# EAGLE design PCB-ACMSLb (EAGLE 6.4)
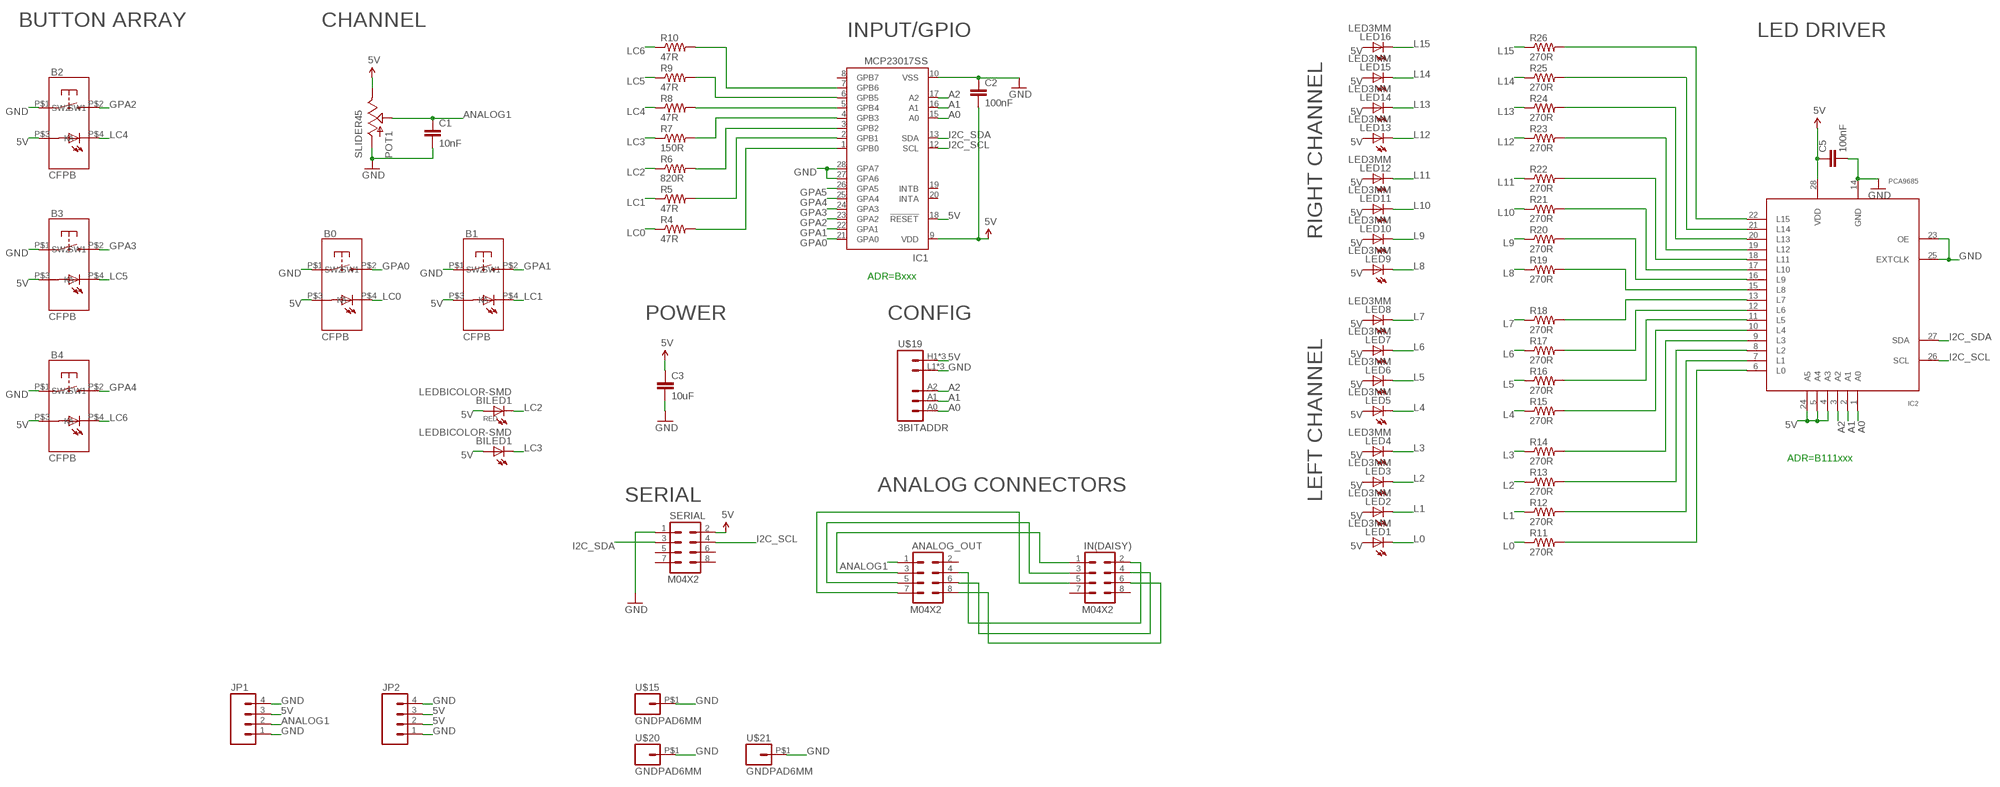
[diagram p0: schematic, sheet 1]

## Parts
ANALOG_OUT  M04X2  [2X4]
B0  CFPB  [CFPB-6/9MM]
B1  CFPB  [CFPB-6/9MM]
B2  CFPB  [CFPB-6/9MM]
B3  CFPB  [CFPB-6/9MM]
B4  CFPB  [CFPB-6/9MM]
BILED1  LEDBICOLOR-SMD  [LEDBICOLOR-SMD]
C1  10nF  CAP0603-CAP  [0603-CAP]
C2  100nF  CAP0603-CAP  [0603-CAP]
C3  10uF  CAP0805  [0805]
C5  100nF  CAP0603-CAP  [0603-CAP]
IC1  MCP23017SS  [SSOP28]
IC2  PCA9685  [TSSOP28]
IN(DAISY)  M04X2  [2X4]
JP1  M04PTH  [1X04]
JP2  M04PTH  [1X04]
LED1  LED3MM  [LED3MM]
LED2  LED3MM  [LED3MM]
LED3  LED3MM  [LED3MM]
LED4  LED3MM  [LED3MM]
LED5  LED3MM  [LED3MM]
LED6  LED3MM  [LED3MM]
LED7  LED3MM  [LED3MM]
LED8  LED3MM  [LED3MM]
LED9  LED3MM  [LED3MM]
LED10  LED3MM  [LED3MM]
LED11  LED3MM  [LED3MM]
LED12  LED3MM  [LED3MM]
LED13  LED3MM  [LED3MM]
LED14  LED3MM  [LED3MM]
LED15  LED3MM  [LED3MM]
LED16  LED3MM  [LED3MM]
POT1  SLIDER45  [SLIDER45]
R4  47R  RESISTOR0603-RES  [0603-RES]
R5  47R  RESISTOR0603-RES  [0603-RES]
R6  820R  RESISTOR0603-RES  [0603-RES]
R7  150R  RESISTOR0603-RES  [0603-RES]
R8  47R  RESISTOR0603-RES  [0603-RES]
R9  47R  RESISTOR0603-RES  [0603-RES]
R10  47R  RESISTOR0603-RES  [0603-RES]
R11  270R  RESISTOR0603-RES  [0603-RES]
R12  270R  RESISTOR0603-RES  [0603-RES]
R13  270R  RESISTOR0603-RES  [0603-RES]
R14  270R  RESISTOR0603-RES  [0603-RES]
R15  270R  RESISTOR0603-RES  [0603-RES]
R16  270R  RESISTOR0603-RES  [0603-RES]
R17  270R  RESISTOR0603-RES  [0603-RES]
R18  270R  RESISTOR0603-RES  [0603-RES]
R19  270R  RESISTOR0603-RES  [0603-RES]
R20  270R  RESISTOR0603-RES  [0603-RES]
R21  270R  RESISTOR0603-RES  [0603-RES]
R22  270R  RESISTOR0603-RES  [0603-RES]
R23  270R  RESISTOR0603-RES  [0603-RES]
R24  270R  RESISTOR0603-RES  [0603-RES]
R25  270R  RESISTOR0603-RES  [0603-RES]
R26  270R  RESISTOR0603-RES  [0603-RES]
SERIAL  M04X2  [2X4]
U$15  GNDPAD6MM  [3.2MMPAD6MM]
U$19  3BITADDR  [3BITADDR]
U$20  GNDPAD6MM  [3.2MMPAD6MM]
U$21  GNDPAD6MM  [3.2MMPAD6MM]

## Nets
5V [Power]: B0.P$3(A) B1.P$3(A) B2.P$3(A) B3.P$3(A) B4.P$3(A) BILED1.P$1(A) BILED1.P$3(A1) C2.2 C3.1 C5.1 IC1.9(VDD) IC1.18(!RESET) IC2.4(A3) IC2.5(A4) IC2.24(A5) IC2.28(VDD) JP1.3 JP2.2 JP2.3 LED1.A LED2.A LED3.A LED4.A LED5.A LED6.A LED7.A LED8.A LED9.A LED10.A LED11.A LED12.A LED13.A LED14.A LED15.A LED16.A POT1.1(E) SERIAL.2 U$19.H1(VCC) U$19.H2(VCC) U$19.H3(VCC)
A0: IC1.15(A0) IC2.1(A0) U$19.A0
A1: IC1.16(A1) IC2.2(A1) U$19.A1
A2: IC1.17(A2) IC2.3(A2) U$19.A2
ANALOG1: ANALOG_OUT.1 C1.1 JP1.2 POT1.2A(S)
GND [Power]: B0.P$1(SW1) B1.P$1(SW1) B2.P$1(SW1) B3.P$1(SW1) B4.P$1(SW1) C1.2 C2.1 C3.2 C5.2 IC1.10(VSS) IC1.27(GPA6) IC1.28(GPA7) IC2.14(GND) IC2.23(OE) IC2.25(EXTCLK) JP1.1 JP1.4 JP2.1 JP2.4 POT1.3(A) SERIAL.1 U$15.P$1 U$19.L1(GND) U$19.L2(GND) U$19.L3(GND) U$20.P$1 U$21.P$1
GPA0 [Signal]: B0.P$2(SW2) IC1.21(GPA0)
GPA1 [Signal]: B1.P$2(SW2) IC1.22(GPA1)
GPA2 [Signal]: B2.P$2(SW2) IC1.23(GPA2)
GPA3 [Signal]: B3.P$2(SW2) IC1.24(GPA3)
GPA4 [Signal]: B4.P$2(SW2) IC1.25(GPA4)
GPA5 [Signal]: IC1.26(GPA5)
I2C_SCL: IC1.12(SCL) IC2.26(SCL) SERIAL.4
I2C_SDA: IC1.13(SDA) IC2.27(SDA) SERIAL.3
L0: LED1.K(C) R11.1
L1: LED2.K(C) R12.1
L2: LED3.K(C) R13.1
L3: LED4.K(C) R14.1
L4: LED5.K(C) R15.1
L5: LED6.K(C) R16.1
L6: LED7.K(C) R17.1
L7: LED8.K(C) R18.1
L8: LED9.K(C) R19.1
L9: LED10.K(C) R20.1
L10: LED11.K(C) R21.1
L11: LED12.K(C) R22.1
L12: LED13.K(C) R23.1
L13: LED14.K(C) R24.1
L14: LED15.K(C) R25.1
L15: LED16.K(C) R26.1
LC0: B0.P$4(K) R4.1
LC1: B1.P$4(K) R5.1
LC2: BILED1.P$2(C) R6.1
LC3: BILED1.P$4(C1) R7.1
LC4: B2.P$4(K) R8.1
LC5: B3.P$4(K) R9.1
LC6: B4.P$4(K) R10.1
N$1: IC2.13(L7) R18.2
N$2: IC1.4(GPB3) R7.2
N$3: IC1.5(GPB4) R8.2
N$4: IC1.6(GPB5) R9.2
N$5: IC1.7(GPB6) R10.2
N$7: IC1.3(GPB2) R6.2
N$8: IC1.2(GPB1) R5.2
N$9: IC1.1(GPB0) R4.2
N$10: ANALOG_OUT.3 IN(DAISY).1
N$11: ANALOG_OUT.5 IN(DAISY).3
N$12: ANALOG_OUT.7 IN(DAISY).5
N$13: ANALOG_OUT.4 IN(DAISY).2
N$14: ANALOG_OUT.6 IN(DAISY).4
N$15: ANALOG_OUT.8 IN(DAISY).6
N$16: IC2.12(L6) R17.2
N$17: IC2.11(L5) R16.2
N$18: IC2.10(L4) R15.2
N$19: IC2.9(L3) R14.2
N$20: IC2.8(L2) R13.2
N$21: IC2.7(L1) R12.2
N$22: IC2.6(L0) R11.2
N$23: IC2.15(L8) R19.2
N$24: IC2.16(L9) R20.2
N$25: IC2.17(L10) R21.2
N$26: IC2.18(L11) R22.2
N$27: IC2.19(L12) R23.2
N$28: IC2.20(L13) R24.2
N$29: IC2.21(L14) R25.2
N$30: IC2.22(L15) R26.2
Unconnected: ANALOG_OUT.2 IC1.8(GPB7) IC1.19(INTB) IC1.20(INTA) IN(DAISY).7 IN(DAISY).8 SERIAL.5 SERIAL.6 SERIAL.7 SERIAL.8

## Notes on the sheet
- BUTTON ARRAY | CHANNEL
- INPUT/GPIO | LED DRIVER
- RIGHT CHANNEL
- ADR=Bxxx
- POWER | CONFIG
- ADR=B111xxx
- ANALOG CONNECTORS
- SERIAL | LEFT CHANNEL

## Library data of the parts
ANALOG_OUT IN(DAISY) SERIAL = SparkFun:M04X2
B0 B1-B4 = SKAARHOJ:CFPB
BILED1 = SKAARHOJ:LEDBICOLOR-SMD
C1-C3 C5 = SparkFun:CAP: Capacitor Standard 0603 ceramic capacitor, and 0.1" leaded capacitor.
IC1 = microchip:MCP23017: http://ww1.microchip.com/downloads/en/DeviceDoc/21952a.pdf Source: http://ww1.microchip.com/downloads/en/DeviceDoc/21952a.pdf; MF: MICROCHIP; MPN: MCP23017-E/SS; OC_FARNELL: 1467674; OC_NEWARK: 31K2960
IC2 = wsmith:PCA9685
JP1 JP2 = SparkFun:M04: Header 4 Standard 4-pin 0.1" header. Use with straight break away headers (SKU : PRT-00116), right angle break away headers (PRT-00553), swiss pins (PRT-00743), machine pins (PRT-00117), and female headers (PRT-00115). Molex polarized connector foot print use with SKU : PRT-08231 with associated crimp pins and housings. 1MM SMD Version SKU: PRT-10208
LED1-LED16 = SKAARHOJ:LED: KINGBRIGHT 20MM BIG LAMP
POT1 = SKAARHOJ:SLIDER
R4-R26 = SparkFun:RESISTOR: Resistor Basic schematic elements and footprints for 0603, 1206, and PTH resistors.
U$15 U$20 U$21 = SKAARHOJ:GNDPAD
U$19 = SKAARHOJ:3BITADDR

## Net classes
0 default: width 0.203 mm, drill 0.406 mm, clearance 0.152 mm
1 Power: width 0.406 mm, drill 0.61 mm, clearance 0.203 mm
2 Signal: width 0.152 mm, clearance 0.152 mm

## Board
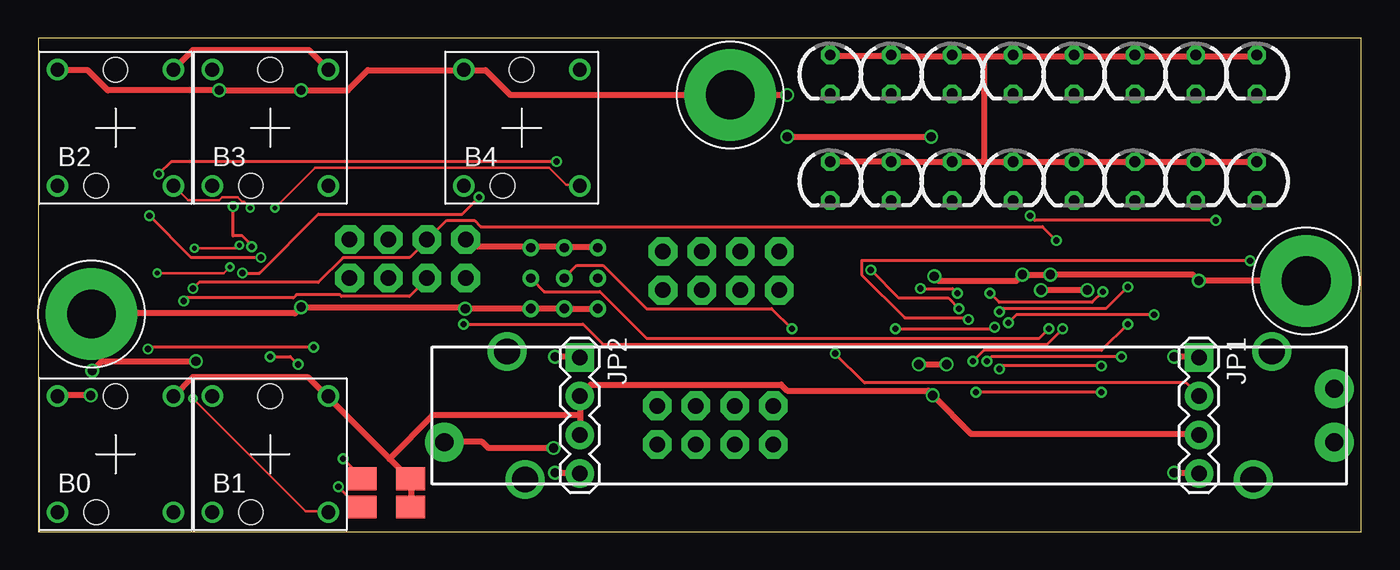
[diagram p1: board, top side]
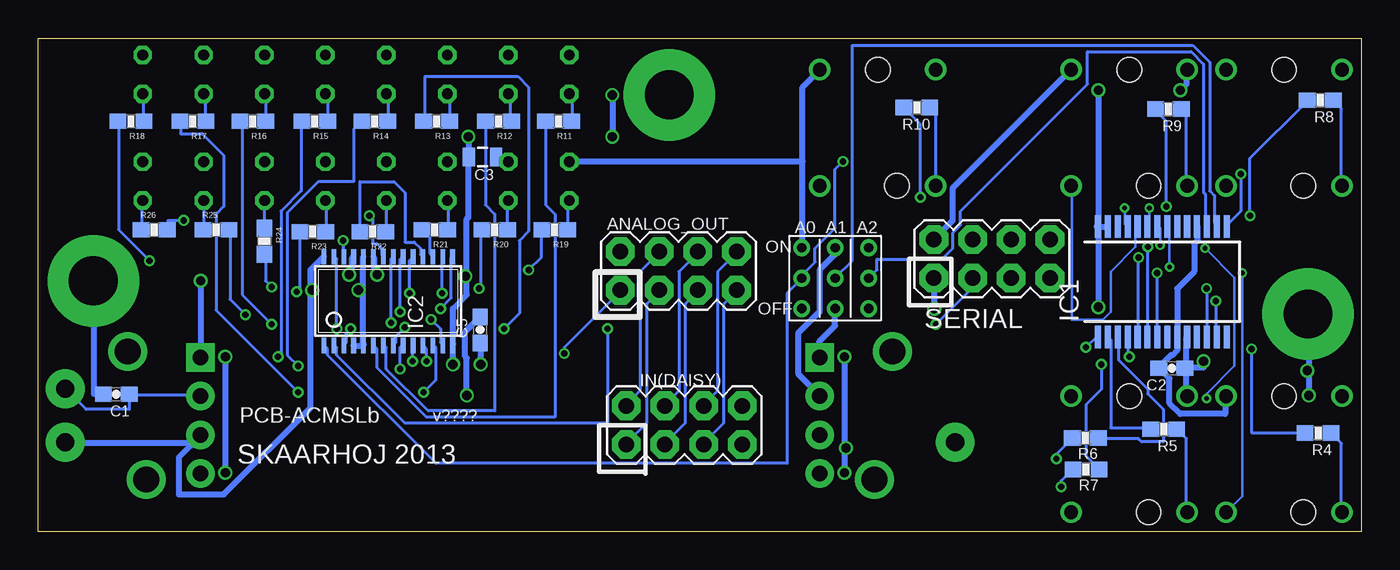
[diagram p2: board, bottom side, seen from below]

Size 86.87 x 32.38 mm. Coordinates in mm from the lower left corner, seen from the top.
Outline: 0,0 86.87,0 86.87,32.38 0,32.38 0,0
Copper layers (1*16): Top 0.035mm / dielectric 1.5mm / Bottom 0.035mm
Design rules "Fusion_eagle_rule_v1.1": minimum track width 6mil, minimum drill 12mil, track to track 6mil, track to pad 6mil, pad to pad 6mil, via to via 6mil, smd to smd 0mil, copper to edge 10mil, drill to drill 10mil, minimum pad ring 10mil, minimum via ring 6mil, stop-mask expansion 2mil, vias tented up to drill 100mil, thermal gap 10mil

### Footprints (pad centres in the part's own frame; a part is rotated, then mirrored left to right if it is on the bottom)
2X4 = drill 1.016 pad 1.88 octagon: 1 -3.81,-1.27; 2 -3.81,1.27; 3 -1.27,-1.27; 4 -1.27,1.27; 5 1.27,-1.27; 6 1.27,1.27; 7 3.81,-1.27; 8 3.81,1.27
CFPB-6/9MM = drill 0.9: P$1 -3.81,3.81; P$2 3.81,-3.81; P$3 3.81,3.81; P$4 -3.81,-3.81 | hole 1.6: 0,3.81; -1.27,-3.81
LEDBICOLOR-SMD = smd 1.9 x 1.5: P$1 1.6,0.925; P$2 -1.6,0.925; P$3 1.6,-0.925; P$4 -1.6,-0.925
0603-CAP = smd 1.1 x 1: 1 -0.85,0; 2 0.85,0
0805 = smd 0.8 x 1.2: 1 -0.9,0; 2 0.9,0
SSOP28 = smd 0.4 x 1.5: 1 -4.225,-3.625; 2 -3.575,-3.625; 3 -2.925,-3.625; 4 -2.275,-3.625; 5 -1.625,-3.625; 6 -0.975,-3.625; 7 -0.325,-3.625; 8 0.325,-3.625; 9 0.975,-3.625; 10 1.625,-3.625; 11 2.275,-3.625; 12 2.925,-3.625; 13 3.575,-3.625; 14 4.225,-3.625; 15 4.225,3.625; 16 3.575,3.625; 17 2.925,3.625; 18 2.275,3.625; 19 1.625,3.625; 20 0.975,3.625; 21 0.325,3.625; 22 -0.325,3.625; 23 -0.975,3.625; 24 -1.625,3.625; 25 -2.275,3.625; 26 -2.925,3.625; 27 -3.575,3.625; 28 -4.225,3.625
TSSOP28 = smd 0.305 x 0.991: 1 -4.225,-2.918; 2 -3.575,-2.918; 3 -2.925,-2.918; 4 -2.275,-2.918; 5 -1.625,-2.918; 6 -0.975,-2.918; 7 -0.325,-2.918; 8 0.325,-2.918; 9 0.975,-2.918; 10 1.625,-2.918; 11 2.275,-2.918; 12 2.925,-2.918; 13 3.575,-2.918; 14 4.225,-2.918; 15 4.225,2.918; 16 3.575,2.918; 17 2.925,2.918; 18 2.275,2.918; 19 1.625,2.918; 20 0.975,2.918; 21 0.325,2.918; 22 -0.325,2.918; 23 -0.975,2.918; 24 -1.625,2.918; 25 -2.275,2.918; 26 -2.925,2.918; 27 -3.575,2.918; 28 -4.225,2.918
1X04 = drill 1.016 pad 1.88 square: 1 0,0 | drill 1.016 pad 1.88: 2 2.54,0; 3 5.08,0; 4 7.62,0
LED3MM = drill 0.7 pad 1.2 octagon: A -1.27,0; K 1.27,0
SLIDER45 = drill 1.194 pad 2.54: 1 -29.21,1.75; 2A -29.21,-1.75; 3 29.21,1.75 | drill 1.702: P$1 -23.9,4.2; P$2 23.9,4.2; P$3 25.1,-4.2; P$4 -25.1,-4.2
0603-RES = smd 1.1 x 1: 1 -0.85,0; 2 0.85,0
3.2MMPAD6MM = drill 3.2 pad 6: P$1 0,0
3BITADDR = drill 0.6: A0 -2.2,0; A1 0,0; A2 2.2,0; H1 -2.2,2; H2 0,2; H3 2.2,2; L1 -2.2,-2; L2 0,-2; L3 2.2,-2

### Placement (x,y rotation side)
ANALOG_OUT  44.83,17.11 0 bottom
B0  5.08,5.08 0 top
B1  15.24,5.08 0 top
B2  5.08,26.5 0 top
B3  15.24,26.5 0 top
B4  31.75,26.5 0 top
BILED1  22.86,2.54 0 top
C1  81.73,9.01 180 bottom
C2  12.44,10.72 180 bottom
C3  57.7,24.58 180 bottom
C5  57.86,13.23 270 bottom
IC1  13.07,16.4 0 bottom
IC2  63.88,15.13 0 bottom
IN(DAISY)  44.45,6.99 0 bottom
JP1  76.2,11.43 270 top
JP2  35.56,11.43 270 top
LED1  52,30 270 top
LED2  56,30 270 top
LED3  60,30 270 top
LED4  64,30 270 top
LED5  68,30 270 top
LED6  72,30 270 top
LED7  76,30 270 top
LED8  80,30 270 top
LED9  52,23 270 top
LED10  56,23 270 top
LED11  60,23 270 top
LED12  64,23 270 top
LED13  68,23 270 top
LED14  72,23 270 top
LED15  76,23 270 top
LED16  80,23 270 top
POT1  55.88,7.62 180 top
R4  2.85,6.47 180 bottom
R5  12.98,6.72 180 bottom
R6  18.12,6.14 0 bottom
R7  18.07,4.07 0 bottom
R8  2.69,28.31 180 bottom
R9  12.66,27.73 180 bottom
R10  29.18,27.83 180 bottom
R11  52.7,26.92 180 bottom
R12  56.64,26.92 180 bottom
R13  60.71,26.92 180 bottom
R14  64.77,26.92 180 bottom
R15  68.71,26.92 180 bottom
R16  72.77,26.92 180 bottom
R17  76.71,26.92 180 bottom
R18  80.77,26.92 180 bottom
R19  52.96,19.81 180 bottom
R20  56.9,19.81 180 bottom
R21  60.83,19.81 180 bottom
R22  64.9,19.68 180 bottom
R23  68.83,19.68 180 bottom
R24  72.01,19.05 270 bottom
R25  75.18,19.81 0 bottom
R26  79.25,19.81 0 bottom
SERIAL  24.26,17.91 0 bottom
U$15  83.24,16.45 0 top
U$19  34.54,16.64 0 bottom
U$20  3.5,14.28 0 top
U$21  45.44,28.66 0 top

### Tracks (layer width: path | path; a pad name or v marks a point on that pad's centre or on a via)
5V  (via drill 0.61)
  Top 0.406: JP1.3 76.2,6.4 61.27,6.4 v58.73,8.94 58.42,9.25 49.17,9.25 48.77,9.65 36.27,9.65 35.66,9.04 JP2.2 35.56,7.62 | v68.89,15.85 v65.84,15.85 | LED9.A 52.12,24.28 55.98,24.28 LED10.A 56.19,24.28 59.94,24.28 LED11.A 60.15,24.28 62.08,24.28 | 62.08,24.28 64.01,24.28 LED12.A 64.21,24.28 67.97,24.28 LED13.A 68.17,24.28 71.93,24.28 LED14.A 72.14,24.28 76,24.28 LED15.A 76.2,24.28 79.96,24.28 LED16.A | LED1.A 51.92,31.19 55.88,31.19 LED2.A 56.08,31.19 59.84,31.19 LED3.A 60.05,31.19 62.08,31.19 | 62.08,31.19 63.8,31.19 LED4.A 64.11,31.19 67.87,31.19 LED5.A 68.07,31.19 71.83,31.19 LED6.A 72.03,31.19 75.79,31.19 LED7.A 76.1,31.19 79.86,31.19 LED8.A | 62.08,31.19 62.08,24.28 | BILED1.P$3 24.49,1.63 24.49,3.45 BILED1.P$1 24.28,3.56 23.06,4.78 | 23.06,4.78 19,8.84 B1.P$3 18.9,8.94 17.68,10.16 10.16,10.16 B0.P$3 | B2.P$3 8.94,30.38 10.16,31.6 17.78,31.6 19,30.38 B3.P$3 | 35.56,7.62 JP2.3 | U$19.H1 36.68,18.69 34.65,18.69 U$19.H2 34.54,18.69 32.41,18.69 U$19.H3 32.21,18.69 28.55,18.69 SERIAL.2 | 23.06,4.78 25.91,7.62 35.56,7.62
  Bottom 0.406: IC2.4 66.14,12.19 65.53,12.19 IC2.5 65.53,12.39 65.53,15.85 | 65.53,15.85 65.53,17.98 IC2.24 | 68.99,15.85 68.99,8.13 74.68,2.44 77.62,2.44 77.62,4.88 76.2,6.3 JP1.3 76.91,5.79 85.04,5.79 POT1.1 | 68.99,15.85 68.99,17.17 68.17,17.98 IC2.28 | v58.73,8.94 58.73,11.38 58.83,11.48 58.83,13.11 57.91,14.02 C5.1 | v65.84,15.85 65.53,15.85 | v68.89,15.85 68.99,15.85 | C3.1 56.79,24.49 56.08,24.49 56.08,24.28 LED10.A | B0.P$3 8.94,8.84 8.94,7.72 11.89,7.72 12.6,8.43 12.6,10.06 13.21,10.67 C2.2 13.21,10.87 12.5,11.58 12.39,11.58 12.09,11.89 12.09,12.6 IC1.9 12.09,12.8 12.09,15.95 10.97,17.07 10.97,18.9 10.77,19.1 10.77,20.02 IC1.18 | 36.68,24.28 36.68,18.69 U$19.H1 | 36.68,24.28 36.68,29.16 35.56,30.28 B4.P$3 | U$19.H2 34.54,18.19 35.56,17.17 35.56,14.43 36.98,13.01 36.98,10.36 35.56,8.94 JP2.2 | SERIAL.2 26.82,20.42 26.82,22.55 19.1,30.28 B3.P$3 | 36.68,24.28 52.02,24.28 LED9.A
A0  (via drill 0.41)
  Top 0.203: v7.92,23.47 8.74,24.28 v34.04,24.28
  Bottom 0.203: IC2.1 68.07,12.19 67.87,11.99 67.87,11.58 60.76,4.47 37.69,4.47 37.69,15.65 36.78,16.56 U$19.A0 36.68,16.66 36.68,16.87 35.87,17.68 35.87,18.59 34.54,19.91 34.54,23.77 v34.04,24.28 | v7.92,23.47 7.92,21.03 8.84,20.12 IC1.15
A1  (via drill 0.41)
  Top 0.203: v49.48,13.31 48.16,14.63 39.93,14.63 37.08,17.48 35.36,17.48 34.54,16.66 U$19.A1
  Bottom 0.203: v49.48,13.31 49.48,7.11 62.79,7.11 67.26,11.58 67.26,12.09 67.36,12.19 IC2.2 | IC1.16 9.55,20.12 9.65,20.22 9.65,22.05 9.96,22.35 9.96,30.79 11.07,31.9 33.43,31.9 33.43,17.78 34.54,16.66 U$19.A1
A2  (via drill 0.41)
  Top 0.203: v66.34,13.31 65.73,12.7 39.93,12.7 36.88,15.75 33.22,15.75 32.41,16.56 U$19.A2
  Bottom 0.203: v66.34,13.31 66.65,13.01 66.65,12.39 66.75,12.29 IC2.3 | IC1.17 10.16,20.12 10.26,20.22 10.26,22.15 10.36,22.25 10.36,30.68 11.18,31.5 17.98,31.5 17.98,29.36 26.31,21.03 26.31,20.12 26.82,19.61 26.82,18.59 27.53,17.88 31.8,17.88 31.8,17.17 32.31,16.66 U$19.A2
ANALOG1  (via drill 0.41)
  Top 0.203: v52.32,11.68 54.25,9.75 75.39,9.75 76.2,8.94 JP1.2
  Bottom 0.203: JP1.2 76.2,8.94 80.87,8.94 C1.1 80.87,8.84 80.87,8.03 83.72,8.03 85.04,9.35 POT1.2A | v52.32,11.68 52.32,12.09 48.67,15.75 ANALOG_OUT.1
GND  (via drill 0.61)
  Top 0.406: v57.81,10.97 v59.64,10.97 | v58.83,16.76 59.13,16.46 64.21,16.46 v64.62,16.87 v66.45,16.87 75.79,16.87 v76.2,16.46 83.21,16.46 U$15.P$1 | v74.57,3.86 76.2,3.86 JP1.4 | v74.57,11.48 76.2,11.48 JP1.1 | v3.45,8.94 1.32,8.94 B0.P$1 | v10.36,11.18 4.17,11.18 v3.56,10.57 | U$19.L1 36.68,14.63 34.65,14.63 U$19.L2 32.41,14.63 U$19.L3 32.21,14.63 v28.04,14.63 27.94,14.73 v17.27,14.73 16.87,14.33 3.56,14.33 U$20.P$1 | v33.93,3.86 35.56,3.86 JP2.4 | v33.93,11.48 35.56,11.48 JP2.1 | v33.83,5.49 29.57,5.49 29.16,5.89 26.72,5.89 POT1.3 | B2.P$1 1.32,30.28 3.25,30.28 4.57,28.96 v11.89,28.96 v17.27,28.96 20.32,28.96 21.64,30.28 27.94,30.28 B4.P$1 28.04,30.28 29.36,30.28 30.99,28.65 45.41,28.65 U$21.P$1 45.62,28.65 v49.17,28.65 | v49.17,25.91 v58.62,25.91
  Bottom 0.406: v66.45,16.87 66.34,16.97 66.34,17.27 66.24,17.37 66.24,17.98 IC2.25 | v64.62,16.87 64.62,17.17 64.82,17.37 64.82,17.98 IC2.23 | v59.64,10.97 59.64,12.19 IC2.14 59.64,12.39 59.64,14.63 58.73,15.54 58.73,16.76 | v57.81,10.97 57.81,12.29 C5.2 | 58.73,16.76 58.73,20.52 58.62,20.62 58.62,24.49 C3.2 58.62,24.79 v58.62,25.91 | v58.83,16.76 58.73,16.76 | v74.57,11.48 v74.57,3.86 | C1.2 82.6,9.04 83.21,9.04 83.21,16.36 U$15.P$1 | v76.2,16.46 JP1.1 | C2.1 11.58,10.77 11.48,10.77 11.48,8.94 B1.P$1 | IC1.10 11.48,12.7 11.48,10.87 C2.1 | 3.45,10.57 3.45,14.22 U$20.P$1 | 3.45,10.57 v3.45,8.94 | v10.36,11.18 10.36,10.77 11.18,10.77 11.28,10.87 C2.1 | v3.56,10.57 3.45,10.57 | U$19.L2 34.54,13.51 35.56,12.5 JP2.1 | v33.93,11.48 33.93,5.49 | 33.93,5.49 v33.93,3.86 | v28.04,14.63 28.04,16.56 SERIAL.1 | v33.83,5.49 33.93,5.49 | IC1.27 16.66,20.02 17.17,20.02 17.27,19.91 17.37,20.02 IC1.28 | v17.27,28.96 17.27,20.22 IC1.28 | v11.89,28.96 11.48,29.36 11.48,30.28 B3.P$1 | v17.27,14.73 17.27,19.81 IC1.28 | v49.17,28.65 v49.17,25.91
GPA0  (via drill 0.3)
  Top 0.152: v12.6,17.37 12.19,16.97 v7.82,16.97
  Bottom 0.152: v12.6,17.37 12.6,19.91 12.7,20.02 IC1.21 | v7.82,16.97 7.82,2.34 B0.P$2
GPA1  (via drill 0.3)
  Top 0.152: v13.21,18.8 13.01,18.59 v10.26,18.59 | v10.16,8.74 17.58,1.32 19,1.32 B1.P$2
  Bottom 0.152: v13.21,18.8 13.21,19.91 13.31,20.02 IC1.22 | v10.26,18.59 8.33,16.66 8.33,10.87 10.16,9.04 v10.16,8.74
GPA2  (via drill 0.3)
  Top 0.152: v13.92,21.23 13.51,21.64 13.41,21.64 13.11,21.95 12.09,21.95 11.89,21.74 9.86,21.74 8.94,22.66 B2.P$2
  Bottom 0.152: v13.92,21.23 13.92,20.22 14.02,20.12 IC1.23
GPA3
  Bottom 0.152: IC1.24 14.73,20.02 14.83,19.91 14.83,18.69 16.46,17.07 16.46,14.43 16.97,13.92 19,13.92 19,22.66 B3.P$2
GPA4  (via drill 0.3)
  Top 0.152: v15.54,21.23 18.19,23.88 33.53,23.88 34.65,22.76 35.56,22.76 B4.P$2
  Bottom 0.152: v15.54,21.23 15.54,20.22 15.44,20.12 IC1.25
I2C_SCL  (via drill 0.41)
  Top 0.203: v66.85,19.1 65.94,20.02 29.06,20.02 28.65,20.42 26.82,20.42 25.6,19.2 SERIAL.4 25.5,19.1 24.38,17.98 20.02,17.98 18.39,16.36 10.57,16.36 v10.16,15.95
  Bottom 0.203: v66.85,19.1 66.85,18.09 IC2.26 | v10.16,15.95 10.16,12.8 IC1.12
I2C_SDA  (via drill 0.41)
  Top 0.203: v67.26,13.31 66.24,12.29 37.08,12.29 35.76,13.61 v27.94,13.61 | v9.55,15.14 9.75,15.34 16.76,15.34 16.97,15.54 19.81,15.54 19.91,15.44 24.38,15.44 25.5,16.56 SERIAL.3
  Bottom 0.203: v67.26,13.31 67.26,17.88 67.36,17.98 IC2.27 | v27.94,13.61 25.6,15.95 25.6,16.56 SERIAL.3 | v9.55,15.14 9.55,12.8 IC1.13
L0
  Bottom 0.203: R11.1 51.82,26.92 51.82,28.65 LED1.K
L1
  Bottom 0.203: R12.1 55.88,26.92 55.88,28.65 LED2.K
L2
  Bottom 0.203: R13.1 59.84,26.92 59.84,28.65 LED3.K
L3
  Bottom 0.203: R14.1 63.91,26.92 63.91,28.65 LED4.K
L4
  Bottom 0.203: R15.1 67.87,28.65 LED5.K
L5
  Bottom 0.203: R16.1 71.93,26.92 71.93,28.65 LED6.K
L6
  Bottom 0.203: R17.1 75.89,26.92 75.89,28.65 LED7.K
L7
  Bottom 0.203: R18.1 79.96,26.92 79.96,28.65 LED8.K
L8
  Bottom 0.203: R19.1 52.12,19.81 52.12,21.64 LED9.K
L9
  Bottom 0.203: R20.1 56.08,19.81 56.08,21.64 LED10.K
L10
  Bottom 0.203: R21.1 59.94,19.81 59.94,21.64 LED11.K
L11
  Bottom 0.203: R22.1 64.01,19.71 64.01,21.64 LED12.K
L12
  Bottom 0.203: R23.1 67.97,19.71 67.97,21.64 LED13.K
L13
  Bottom 0.203: R24.1 72.03,19.91 72.03,21.64 LED14.K
L14
  Bottom 0.203: R25.1 76,19.81 76,21.64 LED15.K
L15
  Bottom 0.203: R26.1 80.06,19.81 80.06,21.64 LED16.K
LC0
  Bottom 0.203: R4.1 1.93,6.4 1.32,5.79 1.32,1.32 B0.P$4
LC1
  Bottom 0.203: R5.1 12.09,6.71 11.48,6.1 11.48,1.32 B1.P$4
LC2  (via drill 0.41)
  Top 0.203: v20.02,4.78 21.23,3.56 BILED1.P$2
  Bottom 0.203: v20.02,4.78 20.02,5.08 19,6.1 R6.1
LC3  (via drill 0.41)
  Top 0.203: v19.71,2.95 21.03,1.63 21.23,1.63 BILED1.P$4
  Bottom 0.203: v19.71,2.95 19.71,3.35 19,4.06 R7.1
LC4
  Bottom 0.203: R8.1 1.83,28.25 1.32,27.74 1.32,22.76 B2.P$4
LC5
  Bottom 0.203: R9.1 11.79,27.64 11.48,27.33 11.48,22.76 B3.P$4
LC6
  Bottom 0.203: B4.P$4 27.94,27.43 28.25,27.74 R10.1
N$1  (via drill 0.41)
  Top 0.203: v61.06,13.92 60.96,14.02 56.9,14.02 54.05,16.87 54.05,17.78 v79.55,17.78
  Bottom 0.203: v61.06,13.92 60.45,13.31 60.45,12.39 60.35,12.29 IC2.13 | v79.55,17.78 81.58,19.81 81.58,26.92 R18.2
N$2  (via drill 0.41)
  Top 0.203: v17.07,10.97 16.56,11.48 v15.24,11.48
  Bottom 0.203: v17.07,10.97 17.07,9.35 18.09,8.33 18.09,4.98 17.27,4.17 R7.2 | v15.24,11.48 15.34,11.58 15.34,12.7 IC1.4
N$3  (via drill 0.41)
  Top 0.203: v7.32,20.73 10.06,17.98 v14.63,17.98
  Bottom 0.203: v7.32,20.73 7.32,24.49 3.56,28.25 R8.2 | v14.63,17.98 14.63,12.8 IC1.5
N$4  (via drill 0.41)
  Top 0.203: v12.8,21.34 12.8,19.41 13.41,19.41 14.02,18.8 v14.02,18.69
  Bottom 0.203: v12.8,21.34 12.8,26.92 13.51,27.64 R9.2 | v14.02,18.69 14.02,12.8 IC1.6
N$5  (via drill 0.41)
  Top 0.203: v28.96,21.95 27.84,20.83 18.39,20.83 14.53,16.97 v13.41,16.97
  Bottom 0.203: v28.96,21.95 28.96,26.72 29.97,27.74 R10.2 | v13.41,16.97 13.41,12.8 IC1.7
N$7
  Bottom 0.203: R6.2 17.17,6.1 14.63,6.1 14.43,5.89 13.01,5.89 13.01,8.03 14.02,9.04 14.02,9.35 15.95,11.28 15.95,12.7 IC1.3
N$8
  Bottom 0.203: R5.2 13.92,6.81 16.46,6.81 16.46,12.6 16.56,12.7 IC1.2
N$9  (via drill 0.41)
  Top 0.203: v7.21,11.99 7.32,12.09 v18.09,12.09
  Bottom 0.203: v7.21,11.99 7.21,6.5 3.76,6.5 R4.2 | v18.09,12.09 17.37,12.8 IC1.1
N$10
  Bottom 0.203: IN(DAISY).1 48.26,5.79 46.94,7.11 46.94,14.94 46.13,15.75 ANALOG_OUT.3
N$11
  Bottom 0.203: IN(DAISY).3 45.72,5.79 44.4,7.11 44.4,14.94 43.59,15.75 ANALOG_OUT.5
N$12
  Bottom 0.203: IN(DAISY).5 43.18,5.79 41.86,7.11 41.86,14.94 41.05,15.75 ANALOG_OUT.7
N$13
  Bottom 0.203: IN(DAISY).2 48.26,8.33 47.35,9.25 47.35,17.07 46.13,18.29 ANALOG_OUT.4
N$14
  Bottom 0.203: IN(DAISY).4 45.72,8.33 44.81,9.25 44.81,17.07 43.59,18.29 ANALOG_OUT.6
N$15
  Bottom 0.203: IN(DAISY).6 43.18,8.33 42.27,9.25 42.27,17.07 41.05,18.29 ANALOG_OUT.8
N$16  (via drill 0.41)
  Top 0.203: v69.8,9.14 v61.57,9.14
  Bottom 0.203: v61.57,9.14 60.76,9.96 60.76,12.09 60.86,12.19 IC2.12 | v69.8,9.14 75.18,14.53 75.18,20.83 74.68,21.34 74.68,24.69 76.1,26.11 77.52,26.11 77.52,26.92 R17.2
N$17  (via drill 0.41)
  Top 0.203: v61.37,11.18 62.08,11.89 69.8,11.89 v71.53,13.61
  Bottom 0.203: v61.37,11.18 61.37,11.99 61.57,12.19 IC2.11 | v71.53,13.61 73.46,15.54 73.46,26.82 73.56,26.92 R16.2
N$18  (via drill 0.41)
  Top 0.203: v62.28,11.18 62.59,11.48 v71.12,11.48
  Bottom 0.203: v62.28,11.18 62.28,12.19 IC2.10 | v71.12,11.48 70.92,11.68 70.92,21.03 69.6,22.35 69.6,26.92 R15.2
N$19  (via drill 0.41)
  Top 0.203: v63.09,10.67 63.3,10.87 v69.8,10.87
  Bottom 0.203: v63.09,10.67 63.09,12.09 62.99,12.19 IC2.9 | v69.8,10.87 70.51,11.58 70.51,20.93 68.48,22.96 66.14,22.96 66.14,26.42 65.63,26.92 R14.2
N$20  (via drill 0.41)
  Top 0.203: v62.79,13.41 62.69,13.31 v56.29,13.31
  Bottom 0.203: v62.79,13.41 63.4,12.8 63.4,12.39 63.5,12.29 IC2.8 | v56.29,13.31 55.27,14.33 55.27,19.1 54.66,19.71 54.66,29.16 55.37,29.87 61.47,29.87 61.47,26.92 R13.2
N$21
  Bottom 0.203: IC2.7 64.11,12.19 64.01,12.09 64.01,10.67 61.27,7.92 56.9,7.92 56.9,20.83 57.51,21.44 57.51,26.92 R12.2
N$22
  Bottom 0.203: IC2.6 64.82,12.19 64.62,11.99 64.62,10.77 61.37,7.52 52.93,7.52 52.93,20.83 53.54,21.44 R11.2
N$23  (via drill 0.41)
  Top 0.203: v60.45,14.63 59.74,15.34 56.49,15.34 v54.66,17.17
  Bottom 0.203: v60.45,14.63 59.74,15.34 59.74,17.98 IC2.15 | v54.66,17.17 53.85,17.98 53.85,19.81 R19.2
N$24  (via drill 0.41)
  Top 0.203: v60.35,15.65 60.05,15.95 v57.91,15.95
  Bottom 0.203: v60.35,15.65 60.35,17.98 IC2.16 | v57.91,15.95 57.81,16.05 57.81,19.81 R20.2
N$25
  Bottom 0.203: IC2.17 60.96,18.09 61.16,18.29 61.16,19.3 R21.2
N$26
  Bottom 0.203: IC2.18 61.67,18.09 61.77,18.19 61.77,18.59 62.18,19 62.79,19 62.79,22.25 63.5,22.96 65.73,22.96 65.73,19.71 R22.2
N$27  (via drill 0.41)
  Top 0.203: v62.48,15.65 63.09,15.04 69.19,15.04 v69.9,15.75
  Bottom 0.203: v62.48,15.65 62.48,17.78 62.28,17.98 IC2.19 | v69.9,15.75 69.7,15.95 69.7,19.61 R23.2
N$28  (via drill 0.41)
  Top 0.203: v63.09,14.43 63.3,14.63 70.1,14.63 v71.53,16.05
  Bottom 0.203: v63.09,14.43 63.09,17.88 62.99,17.98 IC2.20 | v71.53,16.05 71.93,16.46 71.93,18.19 R24.2
N$29  (via drill 0.41)
  Top 0.203: v63.7,13.72 64.21,14.22 v73.25,14.22
  Bottom 0.203: v63.7,13.72 63.7,17.88 63.6,17.98 IC2.21 | v73.25,14.22 74.27,15.24 74.27,19.81 R25.2
N$30  (via drill 0.41)
  Top 0.203: v65.13,20.73 65.43,20.42 v77.32,20.42
  Bottom 0.203: v65.13,20.73 64.92,20.52 64.92,18.9 64.62,18.9 64.31,18.59 64.31,18.19 64.21,18.09 IC2.22 | v77.32,20.42 78.33,20.42 78.33,19.81 R26.2

### Text on the board
_bsilk: v???? | PCB-ACMSLb | SKAARHOJ 2013